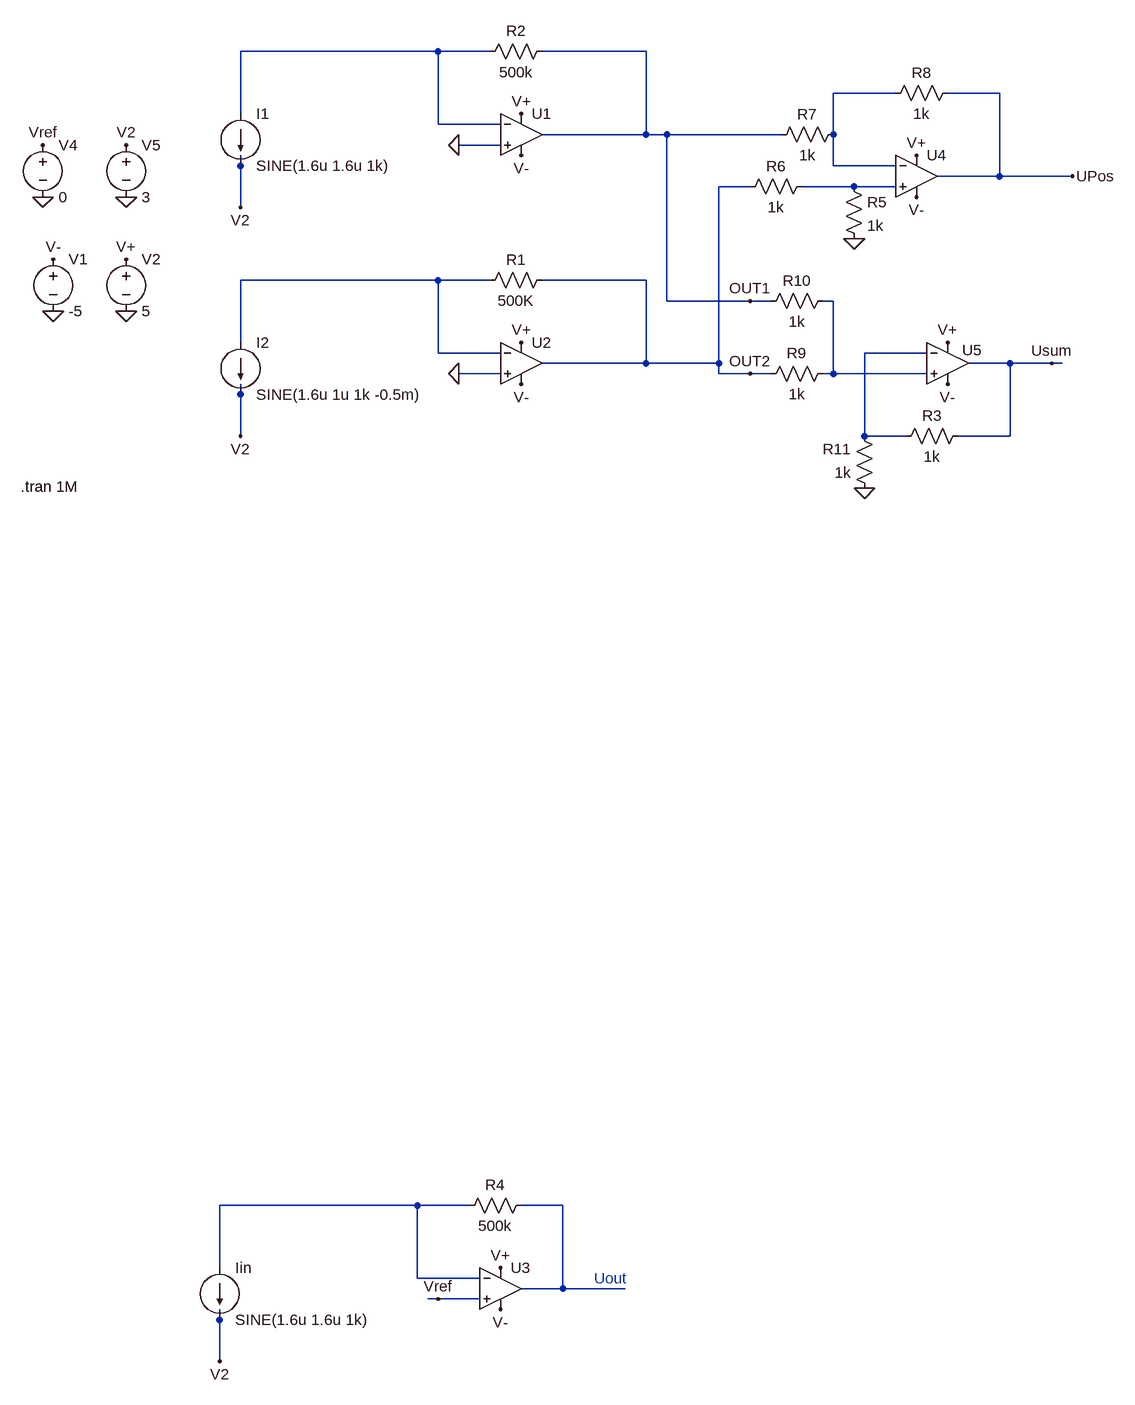
[diagram p0: schematic Draft1.asc]
Draft1.asc, the LTspice schematic file:
Version 4
SHEET 1 1396 1804
WIRE 336 -288 32 -288
WIRE 416 -288 336 -288
WIRE 656 -288 496 -288
WIRE 1040 -224 944 -224
WIRE 1200 -224 1120 -224
WIRE 32 -192 32 -288
WIRE 336 -176 336 -288
WIRE 432 -176 336 -176
WIRE 656 -160 656 -288
WIRE 656 -160 496 -160
WIRE 688 -160 656 -160
WIRE 864 -160 688 -160
WIRE 944 -160 944 -224
WIRE 432 -144 368 -144
WIRE 32 -112 32 -128
WIRE 944 -112 944 -160
WIRE 1040 -112 944 -112
WIRE 1200 -96 1200 -224
WIRE 1200 -96 1104 -96
WIRE 1312 -96 1200 -96
WIRE 816 -80 768 -80
WIRE 976 -80 896 -80
WIRE 1040 -80 976 -80
WIRE 32 -48 32 -112
WIRE 336 64 32 64
WIRE 416 64 336 64
WIRE 656 64 496 64
WIRE 688 96 688 -160
WIRE 816 96 688 96
WIRE 848 96 816 96
WIRE 944 96 928 96
WIRE 32 160 32 64
WIRE 336 176 336 64
WIRE 432 176 336 176
WIRE 1088 176 992 176
WIRE 656 192 656 64
WIRE 656 192 496 192
WIRE 768 192 768 -80
WIRE 768 192 656 192
WIRE 1216 192 1152 192
WIRE 1280 192 1216 192
WIRE 1296 192 1280 192
WIRE 432 208 368 208
WIRE 768 208 768 192
WIRE 816 208 768 208
WIRE 848 208 816 208
WIRE 944 208 944 96
WIRE 944 208 928 208
WIRE 1088 208 944 208
WIRE 32 240 32 224
WIRE 32 304 32 240
WIRE 992 304 992 176
WIRE 1056 304 992 304
WIRE 1216 304 1216 192
WIRE 1216 304 1136 304
WIRE 304 1488 0 1488
WIRE 384 1488 304 1488
WIRE 528 1488 464 1488
WIRE 0 1584 0 1488
WIRE 304 1600 304 1488
WIRE 400 1600 304 1600
WIRE 528 1616 528 1488
WIRE 528 1616 464 1616
WIRE 624 1616 528 1616
WIRE 336 1632 320 1632
WIRE 400 1632 336 1632
WIRE 0 1664 0 1648
WIRE 0 1728 0 1664
FLAG 464 -128 V-
FLAG 464 -192 V+
FLAG -144 32 V+
FLAG -256 32 V-
FLAG -144 112 0
FLAG -256 112 0
FLAG -272 -64 0
FLAG -272 -144 Vref
FLAG 816 96 OUT1
FLAG 32 -48 V2
FLAG -144 -64 0
FLAG -144 -144 V2
FLAG 464 224 V-
FLAG 464 160 V+
FLAG 816 208 OUT2
FLAG 32 304 V2
FLAG 1072 -128 V+
FLAG 1072 -64 V-
FLAG 1120 160 V+
FLAG 1120 224 V-
FLAG 976 0 0
FLAG 1312 -96 UPos
FLAG 992 384 0
FLAG 1280 192 Usum
FLAG 432 1648 V-
FLAG 432 1584 V+
FLAG 0 1728 V2
FLAG 336 1632 Vref
FLAG 368 -144 0
FLAG 368 208 0
SYMBOL OpAmps\\UniversalOpamp2 464 -160 R0
SYMATTR InstName U1
SYMBOL res 512 -304 R90
WINDOW 0 0 56 VBottom 2
WINDOW 3 32 56 VTop 2
SYMATTR InstName R2
SYMATTR Value 500k
SYMBOL voltage -256 16 R0
WINDOW 123 0 0 Left 0
WINDOW 39 0 0 Left 0
SYMATTR InstName V1
SYMATTR Value -5
SYMBOL voltage -144 16 R0
WINDOW 123 0 0 Left 0
WINDOW 39 0 0 Left 0
SYMATTR InstName V2
SYMATTR Value 5
SYMBOL voltage -272 -160 R0
WINDOW 123 0 0 Left 0
WINDOW 39 0 0 Left 0
SYMATTR InstName V4
SYMATTR Value 0
SYMBOL current 32 -192 R0
WINDOW 123 0 0 Left 0
WINDOW 39 0 0 Left 0
SYMATTR InstName I1
SYMATTR Value SINE(1.6u 1.6u 1k)
SYMBOL voltage -144 -160 R0
WINDOW 123 0 0 Left 0
WINDOW 39 0 0 Left 0
SYMATTR InstName V5
SYMATTR Value 3
SYMBOL OpAmps\\UniversalOpamp2 464 192 R0
SYMATTR InstName U2
SYMBOL res 512 48 R90
WINDOW 0 0 56 VBottom 2
WINDOW 3 32 56 VTop 2
SYMATTR InstName R1
SYMATTR Value 500K
SYMBOL current 32 160 R0
WINDOW 123 0 0 Left 0
WINDOW 39 0 0 Left 0
SYMATTR InstName I2
SYMATTR Value SINE(1.6u 1u 1k -0.5m)
SYMBOL OpAmps\\UniversalOpamp2 1072 -96 R0
SYMATTR InstName U4
SYMBOL OpAmps\\UniversalOpamp2 1120 192 R0
WINDOW 0 22 -20 Left 2
SYMATTR InstName U5
SYMBOL res 960 -96 R0
SYMATTR InstName R5
SYMATTR Value 1k
SYMBOL res 912 -96 R90
WINDOW 0 0 56 VBottom 2
WINDOW 3 32 56 VTop 2
SYMATTR InstName R6
SYMATTR Value 1k
SYMBOL res 960 -176 R90
WINDOW 0 0 56 VBottom 2
WINDOW 3 32 56 VTop 2
SYMATTR InstName R7
SYMATTR Value 1k
SYMBOL res 1136 -240 R90
WINDOW 0 0 56 VBottom 2
WINDOW 3 32 56 VTop 2
SYMATTR InstName R8
SYMATTR Value 1k
SYMBOL res 944 192 R90
WINDOW 0 0 56 VBottom 2
WINDOW 3 32 56 VTop 2
SYMATTR InstName R9
SYMATTR Value 1k
SYMBOL res 944 80 R90
WINDOW 0 0 56 VBottom 2
WINDOW 3 32 56 VTop 2
SYMATTR InstName R10
SYMATTR Value 1k
SYMBOL res 1008 400 R180
WINDOW 0 36 76 Left 2
WINDOW 3 36 40 Left 2
SYMATTR InstName R11
SYMATTR Value 1k
SYMBOL res 1152 288 R90
WINDOW 0 0 56 VBottom 2
WINDOW 3 32 56 VTop 2
SYMATTR InstName R3
SYMATTR Value 1k
SYMBOL OpAmps\\UniversalOpamp2 432 1616 R0
SYMATTR InstName U3
SYMBOL res 480 1472 R90
WINDOW 0 0 56 VBottom 2
WINDOW 3 32 56 VTop 2
SYMATTR InstName R4
SYMATTR Value 500k
SYMBOL current 0 1584 R0
WINDOW 123 0 0 Left 0
WINDOW 39 0 0 Left 0
SYMATTR InstName Iin
SYMATTR Value SINE(1.6u 1.6u 1k)
TEXT -306 382 Left 2 !.tran 1M
TEXT 576 1600 Left 2 ;Uout

The netlist it stands for:
* Draft1.asc
XU1 0 N001 V+ V- OUT1 level.2 Avol=1Meg GBW=10Meg Slew=10Meg ilimit=25m rail=0 Vos=0 phimargin=45 en=0 enk=0 in=0 ink=0 Rin=500Meg  ; pins IN+ IN- V+ V- OUT
R2 OUT1 N001 500k
V1 V- 0 -5
V2 V+ 0 5
V4 Vref 0 0
I1 N001 V2 SINE(1.6u 1.6u 1k)
V5 V2 0 3
XU2 0 N004 V+ V- OUT2 level.2 Avol=1Meg GBW=10Meg Slew=10Meg ilimit=25m rail=0 Vos=0 phimargin=45 en=0 enk=0 in=0 ink=0 Rin=500Meg  ; pins IN+ IN- V+ V- OUT
R1 OUT2 N004 500K
I2 N004 V2 SINE(1.6u 1u 1k -0.5m)
XU4 N003 N002 V+ V- UPos level.2 Avol=1Meg GBW=10Meg Slew=10Meg ilimit=25m rail=0 Vos=0 phimargin=45 en=0 enk=0 in=0 ink=0 Rin=500Meg  ; pins IN+ IN- V+ V- OUT
XU5 N005 N006 V+ V- Usum level.2 Avol=1Meg GBW=10Meg Slew=10Meg ilimit=25m rail=0 Vos=0 phimargin=45 en=0 enk=0 in=0 ink=0 Rin=500Meg  ; pins IN+ IN- V+ V- OUT
R5 N003 0 1k
R6 N003 OUT2 1k
R7 N002 OUT1 1k
R8 UPos N002 1k
R9 N005 OUT2 1k
R10 N005 OUT1 1k
R11 0 N006 1k
R3 Usum N006 1k
XU3 Vref N007 V+ V- N008 level.2 Avol=1Meg GBW=10Meg Slew=10Meg ilimit=25m rail=0 Vos=0 phimargin=45 en=0 enk=0 in=0 ink=0 Rin=500Meg  ; pins IN+ IN- V+ V- OUT
R4 N008 N007 500k
Iin N007 V2 SINE(1.6u 1.6u 1k)
.tran 1M
* Uout
.lib UniversalOpamps2.sub
.backanno
.end